# Altium schematic sheet Capacitive Soil Moisture Sensor Overview.SchDoc: Title
size Letter; Revision: A; DesignedBy: Craig Comberbach
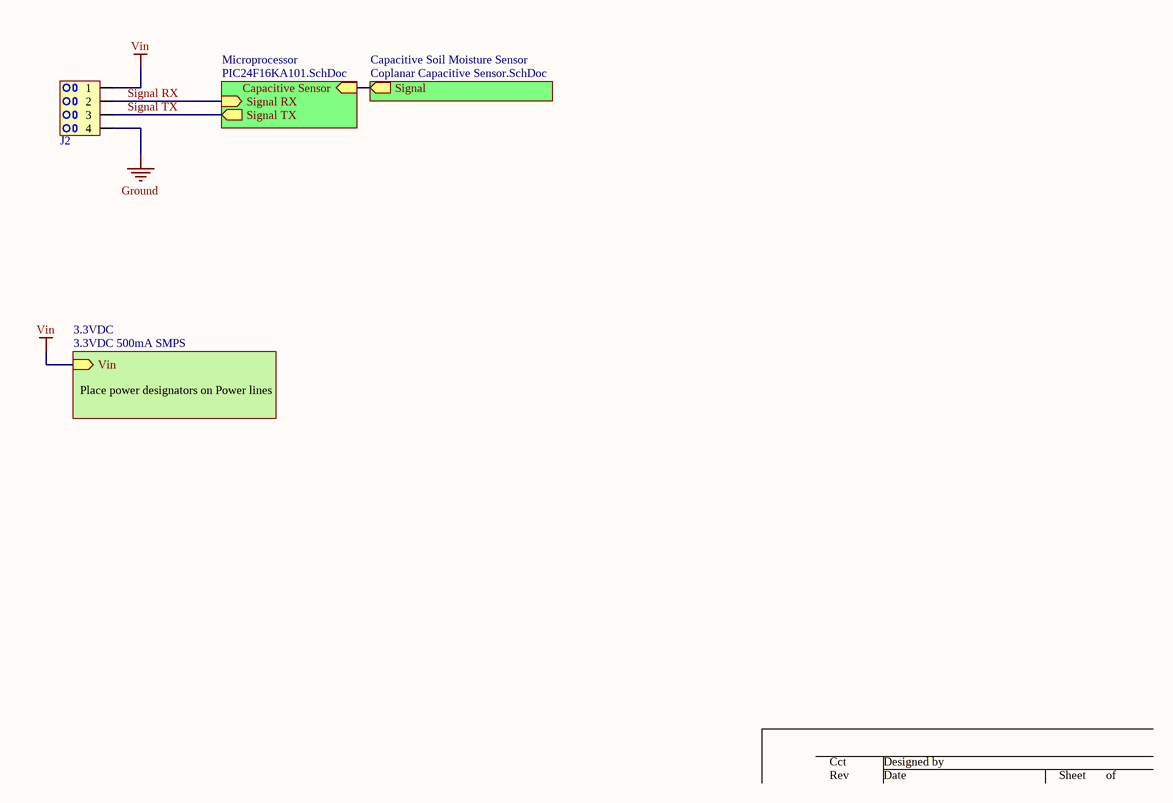
[diagram p0: Capacitive Soil Moisture Sensor Overview.SchDoc]

## Parts
J2  4-Position Screwless Connector 2.5mm Pitch Right Angle  [4-Position Screwless Connector 2.5mm pitch Right Angle]  (value not drawn)

## Sub-sheets
3.3VDC = 3.3VDC 500mA SMPS: Vin (in)
Capacitive Soil Moisture Sensor = Coplanar Capacitive Sensor.SchDoc: Signal (out)
Microprocessor = PIC24F16KA101.SchDoc: Capacitive Sensor (in), Signal TX (out), Signal RX (in)

## Nets
Ground: J2.4
Vin: J2.1 ; sheet 3.3VDC/Vin
Signal RX: J2.2 ; sheet Microprocessor/Signal RX
Signal TX: J2.3 ; sheet Microprocessor/Signal TX
(unnamed): sheet Microprocessor/Capacitive Sensor, sheet Capacitive Soil Moisture Sensor/Signal

## Notes on the sheet
- Place power designators on Power lines
- Cct
- Designed by
- Rev
- Date
- Sheet
- of

## Library data of the parts
J2 = 4-Position Screwless Connector 2.5mm Pitch Right Angle: Manufacturer: Phoenix Contact; Manufacturer Part Number: 1702474; Number of Levels: 1; Positions Per Level: 4; Pitch: 0.098" (2.50mm); Mating Orientation: Horizontal with Board; Current: 5A; Voltage: 150V; Wire Gauge: 20-26 AWG; Wire Termination: Screwless - Spring Cage, Tension Clamp; Supplier 1: Digi-Key; Supplier Part Number 1: 277-2338-1-ND; RoHS: RoHS Compliant; Category: Connectors, Interconnects; Stock 1: 1600; Pricing 1: 1=1.14, 10=1.057, 50=1.0126, 100=0.9685, 250=0.94208 (CAD); Packaging: Cut Tape (CT); Mounting Type: Surface Mount; Features: Solder Retention; Color: Black; Operating Temperature: -; Housing Material: Liquid Crystal Polymer (LCP); Contact Material - Plating: -; Clamp Material - Plating: -; Screw Material - Plating: -; Torque - Screw: -; Screw Thread: -; ComponentLink1URL: http://media.digikey.com/PDF/Data%20Sheets/Phoenix%20Contact%20PDFs/1702474.pdf; ComponentLink1Description: Spec Sheet